# Altium schematic sheet MezzanineBreakout.SchDoc
size A; SheetNumber: 1; SheetTotal: 1
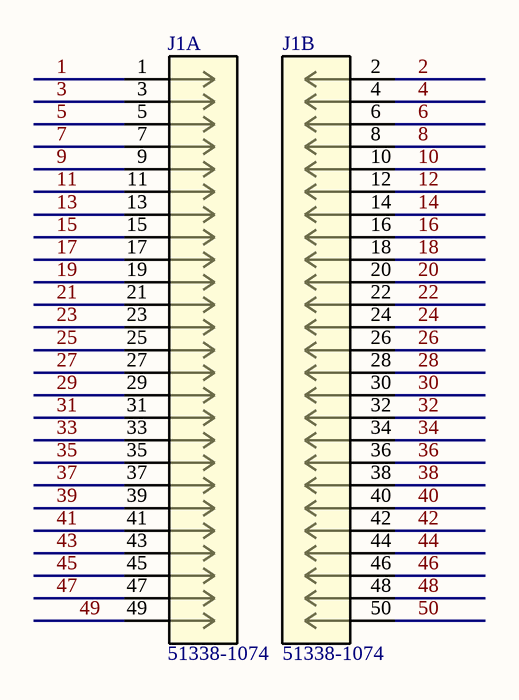
[diagram p0: MezzanineBreakout.SchDoc]

## Parts
J1  51338-1074  [51338-1074]  (parts A,B of 2)

## Nets
1: J1.1
2: J1.2
3: J1.3
4: J1.4
5: J1.5
6: J1.6
7: J1.7
8: J1.8
9: J1.9
10: J1.10
11: J1.11
12: J1.12
13: J1.13
14: J1.14
15: J1.15
16: J1.16
17: J1.17
18: J1.18
19: J1.19
20: J1.20
21: J1.21
22: J1.22
23: J1.23
24: J1.24
25: J1.25
26: J1.26
27: J1.27
28: J1.28
29: J1.29
30: J1.30
31: J1.31
32: J1.32
33: J1.33
34: J1.34
35: J1.35
36: J1.36
37: J1.37
38: J1.38
39: J1.39
40: J1.40
41: J1.41
42: J1.42
43: J1.43
44: J1.44
45: J1.45
46: J1.46
47: J1.47
48: J1.48
49: J1.49
50: J1.50

## Library data of the parts
J1 = 51338-1074: Board Connector, 100 Contact(s), 2 Row(s), Female, Straight, 0.016 inch Pitch, Surface Mount Terminal, Locking, Black Insulator, Receptacle; Manufacturer: Molex; Option: General Purpose; Filter Feature: No; Mating Information: MULTIPLE MATING PARTS AVAILABLE; Number of Rows Loaded: 2; Number of Contacts: 100; Board Mounting Option: FITTING NAIL; Contact Pattern: RECTANGULAR; Contact Resistance: 40mR; Insulation Resistance: 100MR; Number Of Connectors: 1; Rated Current (Signal): 300mA; Body Breadth: 0.134inch; Body Depth: 0.053inch; Body Length: 0.909inch; Mating Contact Row Spacing: 0.043inch; PCB Contact Row Spacing: 1.4986mm; Reference Standard: UL; Reliability: COMMERCIAL; Supplier: Mouser; Supplier Part Number: 538-51338-1074; Manufacturer Part Number: 51338-1074; RoHS: Yes; Category: Headers and Wire Housings; Stock: 1434; Pricing: 1=3.42, 10=3.08, 50=3.08, 100=2.57, 500=2.56, 1000=2.27, 10000=2.27 (USD); Mounting Technology: Board; Contact Finish - Mating: GOLD; Contact Finish - Termination: GOLD; Insulation Color: Black; Insulation Material: Polymer; Min Operating Temperature: -25°C; Max Operating Temperature: 85°C; Connector Type: BOARD CONNECTOR; JESD-609 Code: e4; Contact Gender: Female; Mixed Contacts: No; Mounting Style: STRAIGHT; Termination: SMD/SMT; Body/Shell Style: RECEPTACLE; Number Of PCB Rows: 2; PCB Contact Pattern: RECTANGULAR; Terminal Pitch: 0.4mm; Mating Contact Pitch: 0.016inch; Mounting Option 1: LOCKING; Flammability Rating: UL94 V-0; DIN Conformance: No; IEC Conformance: No; MIL Conformance: No; Reach SVHC Compliant: Yes; RoHS Compliant: Yes; ComponentLink1URL: https://datasheet.ciiva.com:443/pdfs/VipMasterIC/IC/MOLE/MOLE-S-A0003536377/MOLE-S-A0003536377-1.pdf?src-supplier=IHS+Markit; ComponentLink1Description: https://datasheet.ciiva.com:443/pdfs/VipMasterIC/IC/MOLE/MOLE-S-A0003536377/MOLE-S-A0003536377-1.pdf?src-supplier=IHS+Markit; ComponentLink2URL: https://datasheet.ciiva.com/5129/0513381074-pcb-receptacles-149270-5129725.pdf?src-supplier=Mouser; ComponentLink2Description: https://datasheet.ciiva.com/5129/0513381074-pcb-receptacles-149270-5129725.pdf?src-supplier=Mouser; ComponentLink3URL: https://datasheet.ciiva.com/46409/1597556-46409754.pdf?src-supplier=Element14; ComponentLink3Description: https://datasheet.ciiva.com/46409/1597556-46409754.pdf?src-supplier=Element14